# EAGLE design v1 (EAGLE 6.4)
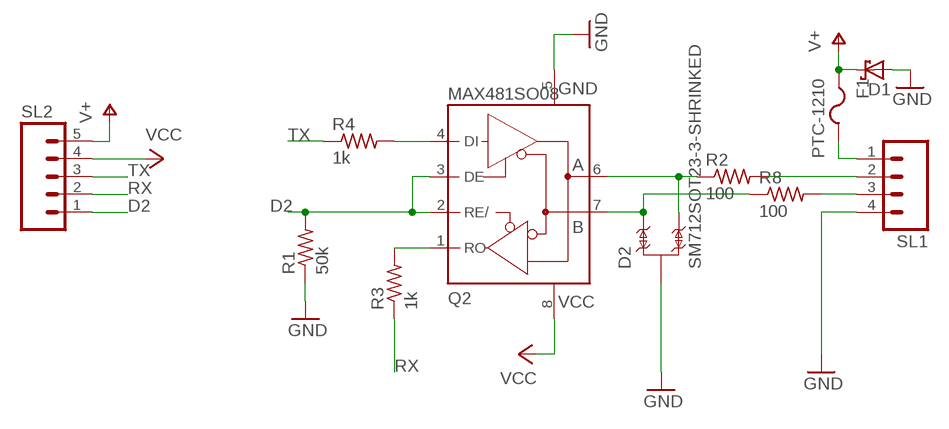
[diagram p0: schematic, sheet 1]

## Parts
D1  SCHOTTKY-DIODESMC  [SMC]
D2  SM712SOT23-3-SHRINKED  [SOT23-3-SHRINKED]
F1  PTC-1210  [1210]
Q2  MAX481SO08  [SO08]
R1  50k  R-US_R0603  [R0603]
R2  100  R-US_R0603  [R0603]
R3  1k  R-US_R0603  [R0603]
R4  1k  R-US_R0603  [R0603]
R8  100  R-US_R0603  [R0603]
SL1  M04  [04P]
SL2  M05  [05P]

## Nets
D2: Q2.2(RE/) Q2.3(DE) R1.2 SL2.1
GND: D1.A D2.3 Q2.5(GND) R1.1 SL1.4
N$1: F1.2 SL1.1
N$4: D2.2 Q2.7(B) R8.1
N$5: Q2.1(RO) R3.2
N$6: Q2.4(DI) R4.2
N$7: R8.2 SL1.3
N$8: R2.2 SL1.2
N$9: D2.1 Q2.6(A) R2.1
RX: R3.1 SL2.2
TX: R4.1 SL2.3
V+: D1.C F1.1 SL2.5
VCC: Q2.8(+5V) SL2.4

## Library data of the parts
D1 = diode:SCHOTTKY-DIODE: Schottky Diode
D2 = serge:SM712: SM712 Series 600W Asymmetrical TVS Diode Array; Datasheet: http://www.littelfuse.com/~/media/electronics/datasheets/tvs_diode_arrays/littelfuse_tvs_diode_array_sm712_datasheet.pdf.pdf
F1 = serge:PTC-1210
Q2 = serge:MAX481
R1-R4 R8 = adafruit:R-US_: RESISTOR, American symbol
SL1 = con-amp-quick:M04: AMP QUICK CONNECTOR; OC_FARNELL: unknown; OC_NEWARK: unknown
SL2 = con-amp-quick:M05: AMP QUICK CONNECTOR; OC_FARNELL: unknown; OC_NEWARK: unknown

## Board
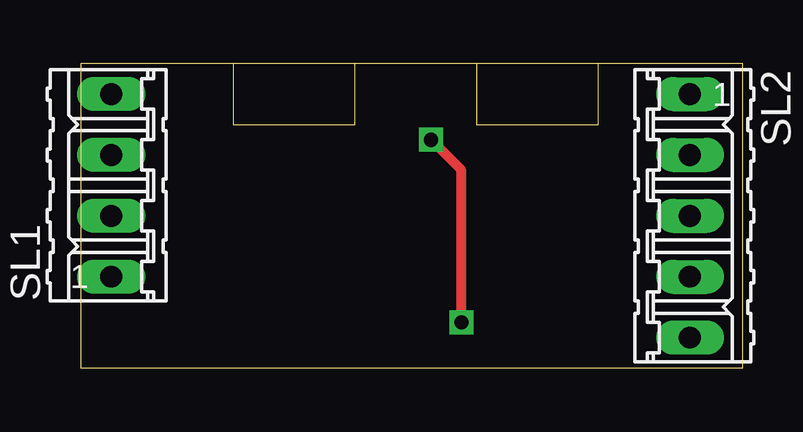
[diagram p1: board, top side]
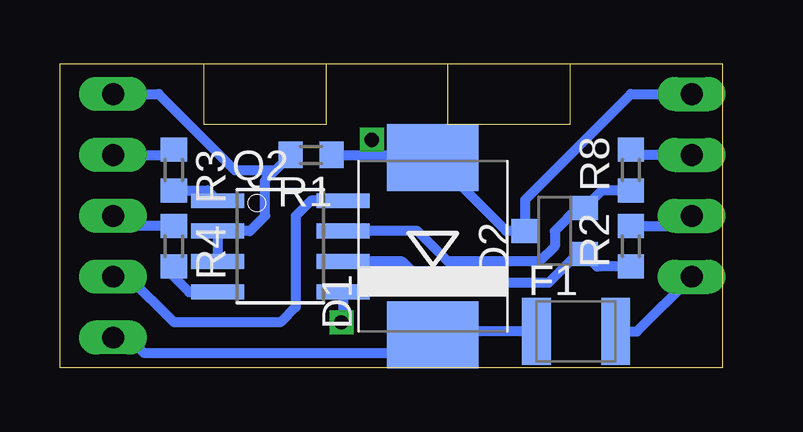
[diagram p2: board, bottom side, seen from below]

Size 27.61 x 12.7 mm. Coordinates in mm from the lower left corner, seen from the top.
Outline: 6.35,12.7 6.35,10.16 11.43,10.16 11.43,12.7
Outline: 16.51,12.7 16.51,10.16 21.59,10.16 21.59,12.7
Outline: 0,0 27.61,0 27.61,12.69 0,12.69 0,0
Copper layers (1*16): Top 0.035mm / dielectric 1.5mm / Bottom 0.035mm
Design rules "default": minimum track width 10mil, minimum drill 24mil, track to track 16mil, track to pad 16mil, pad to pad 16mil, via to via 16mil, smd to smd 16mil, copper to edge 16mil, drill to drill 8mil, minimum pad ring 10mil, minimum via ring 8mil, stop-mask expansion 4mil, vias tented up to drill 0mil, thermal gap 10mil

### Footprints (pad centres in the part's own frame; a part is rotated, then mirrored left to right if it is on the bottom)
SMC = smd 2.8 x 3.8: A 3.7,0; C -3.7,0
SOT23-3-SHRINKED = smd 1 x 1.146: 1 -0.95,-1.227; 2 0.95,-1.227; 3 0,1.227
1210 = smd 1.2 x 2.8: 1 -1.65,0; 2 1.65,0
SO08 = smd 0.61 x 2.21: 1 -1.905,-2.616; 2 -0.635,-2.616; 3 0.635,-2.616; 4 1.905,-2.616; 5 1.905,2.616; 6 0.635,2.616; 7 -0.635,2.616; 8 -1.905,2.616
R0603 = smd 1 x 1.1: 1 -0.85,0; 2 0.85,0
04P = drill 0.914 long: 1 -3.81,0; 2 -1.27,0; 3 1.27,0; 4 3.81,0
05P = drill 0.914 long: 1 -5.08,0; 2 -2.54,0; 3 0,0; 4 2.54,0; 5 5.08,0

### Placement (x,y rotation side)
D1  12.06,5.08 90 bottom
D2  6.99,5.71 90 bottom
F1  6.1,1.52 0 bottom
Q2  18.41,5.08 270 bottom
R1  17.14,8.89 180 bottom
R2  3.81,5.08 90 bottom
R3  22.86,8.26 270 bottom
R4  22.86,5.08 270 bottom
R8  3.81,8.26 90 bottom
SL1  1.27,7.62 90 top
SL2  25.4,6.35 270 top

### Tracks (layer width: path | path; a pad name or v marks a point on that pad's centre or on a via)
D2
  Bottom 0.406: Q2.3 Q2.2 19.68,5.71 19.05,6.35 19.05,7.83 18.63,8.26 | R1.2 18.52,8.36 18.63,8.26 | SL2.1 23.5,11.43 20.32,8.26 18.63,8.26
GND  (via drill 0.6)
  Top 0.406: v15.88,1.91 15.88,8.26 v14.61,9.53
  Bottom 0.406: SL1.4 3.81,11.43 8.21,7.03 D2.3 9,5.71 D1.A 12.18,8.89 14.61,8.89 | R1.1 14.61,8.89 | Q2.5 15.8,1.98 v15.88,1.91 | v14.61,9.53 14.61,8.89
N$1
  Bottom 0.406: F1.2 3.56,1.52 SL1.1
N$4
  Bottom 0.406: R8.1 5.02,7.41 D2.2 6.04,6.67 6.99,5.71 6.99,5.08 7.62,4.45 11.43,4.45 12.7,5.71 Q2.7
N$5
  Bottom 0.406: R3.2 21.45,7.41 Q2.1
N$6
  Bottom 0.406: R4.2 22.86,3.81 22.23,3.17 Q2.4
N$7
  Bottom 0.406: SL1.3 3.6,8.89 R8.2
N$8
  Bottom 0.406: R2.2 1.69,5.93 SL1.2
N$9
  Bottom 0.406: R2.1 5.22,4.23 D2.1 6.03,4.76 7.24,3.56 12.45,3.56 13.34,4.45 Q2.6
RX
  Bottom 0.406: SL2.2 23.07,8.89 R3.1
TX
  Bottom 0.406: R4.1 24.98,5.93 SL2.3
V+
  Bottom 0.406: 12.18,1.27 D1.C | SL2.5 24.77,1.27 24.13,0.64 12.81,0.64 D1.C | F1.1 11.92,1.52 D1.C
VCC
  Bottom 0.406: Q2.8 17.14,6.99 17.78,6.35 17.78,2.54 18.41,1.91 22.86,1.91 24.77,3.81 SL2.4